# Altium project RF-UNIT-BIG.PrjPcb
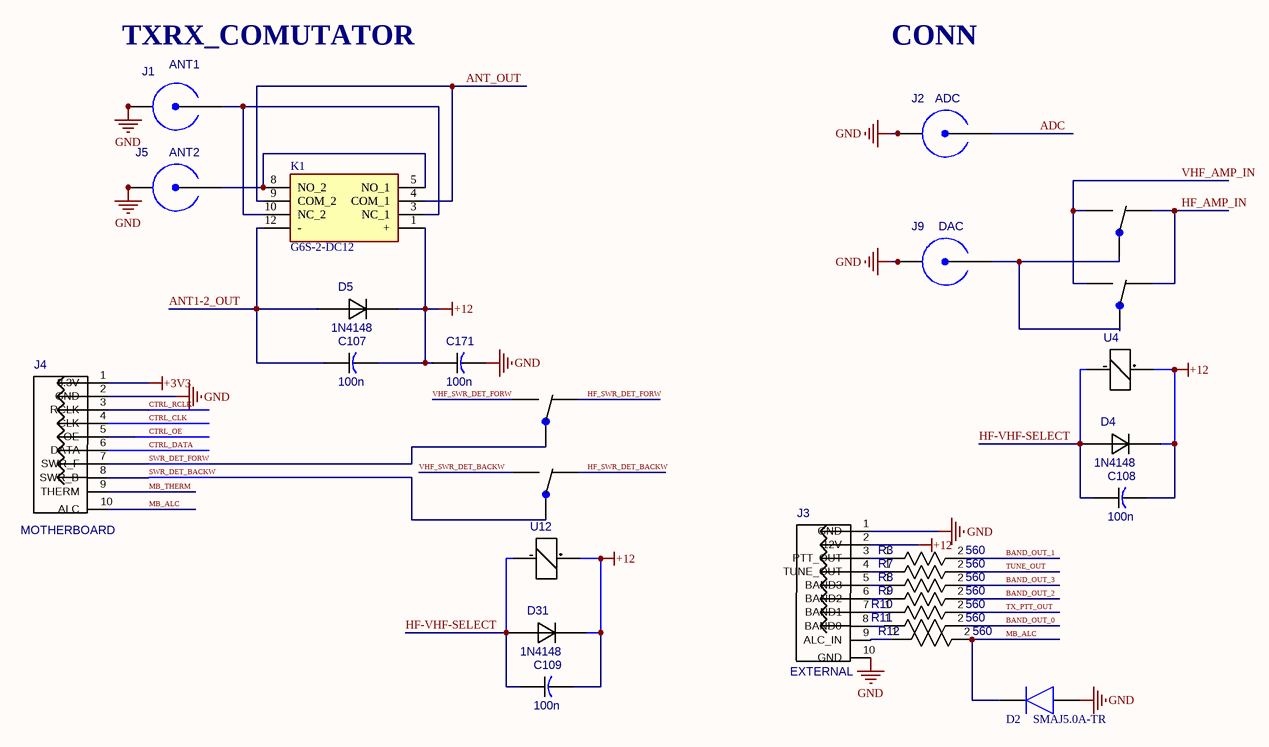
[diagram p0: CONN.SchDoc]
8 sheets, 354 parts. Net scope: global (net labels, ports and power ports of the same name join across sheets).
Board file: RF-UNIT-BIG.PcbDoc
Sheets:
  CONN.SchDoc
  LNA.SchDoc
  BPF.SchDoc
  HF_AMP.SchDoc
  HF_AMP_DRIVER.SchDoc
  SWR_HF.SchDoc
  VHF_AMP.SchDoc
  SWR_VHF.SchDoc

## Sheet CONN.SchDoc: CONNECTIONS
size A4; DocumentNumber: 14; Revision: 2.0; SheetNumber: 14; SheetTotal: 18

### Parts
C107  100n  [CAP_0805]
C108  100n  [CAP_0805]
C109  100n  [CAP_0805]
C171  100n  [CAP_0805]
D2  SMAJ5.0A-TR  [SMBJ36CATR]
D4  1N4148  [SS14]
D5  1N4148  [SS14]
D31  1N4148  [SS14]
J1  ANT1  [31-5431]
J2  ADC  [31-5431]
J3  EXTERNAL  [90131-0126]
J4  MOTHERBOARD  [90131-0126]
J5  ANT2  [31-5431]
J9  DAC  [31-5431]
K1  G6S-2-DC12  [G6S2DC12]
R3  560  [RES_0805]
R7  560  [RES_0805]
R8  560  [RES_0805]
R9  560  [RES_0805]
R10  560  [RES_0805]
R11  560  [RES_0805]
R12  560  [RES_0805]
U4  Axicom IM06  [IM06GR]  (value not drawn)
U12  Axicom IM06  [IM06GR]  (value not drawn)

### Nets
+3V3: J4.1(3.3V)
+12: C107.2 C108.2 C109.2 C171.1 D4.1(K) D5.1(K) D31.1(K) J3.2(12V) K1.1(+) U4.1(+) U12.1(+)
GND: C171.2 D2.2(A) J1.1(GND) J1.2(GND) J1.3(GND) J1.4(GND) J2.1(GND) J2.2(GND) J2.3(GND) J2.4(GND) J3.1(GND) J3.10(GND) J4.2(GND) J5.1(GND) J5.2(GND) J5.3(GND) J5.4(GND) J9.1(GND) J9.2(GND) J9.3(GND) J9.4(GND)
ADC: J2.5(CON)
ANT1-2_OUT: C107.1 D5.2(A) K1.12(-)
ANT_OUT: K1.4(COM_1) K1.9(COM_2)
BAND_OUT_0: R11.2
BAND_OUT_1: R3.2
BAND_OUT_2: R9.2
BAND_OUT_3: R8.2
CTRL_CLK: J4.4(CLK)
CTRL_DATA: J4.6(DATA)
CTRL_OE: J4.5(OE)
CTRL_RCLK: J4.3(RCLK)
HF-VHF-SELECT: C108.1 C109.1 D4.2(A) D31.2(A) U4.8(-) U12.8(-)
HF_AMP_IN: U4.2(O) U4.7(O)
HF_SWR_DET_BACKW: U12.2(O)
HF_SWR_DET_FORW: U12.7(O)
MB_ALC: D2.1(K) J4.10(ALC) R12.2
MB_THERM: J4.9(THERM)
SWR_DET_BACKW: J4.8(SWR_B) U12.3(P)
SWR_DET_FORW: J4.7(SWR_F) U12.6(P)
TUNE_OUT: R7.2
TX_PTT_OUT: R10.2
VHF_AMP_IN: U4.4(S) U4.5(S)
VHF_SWR_DET_BACKW: U12.4(S)
VHF_SWR_DET_FORW: U12.5(S)
NetJ1_5: J1.5(CON) K1.3(NC_1) K1.10(NC_2)
NetJ3_3: J3.3(PTT_OUT) R3.1
NetJ3_4: J3.4(TUNE_OUT) R7.1
NetJ3_5: J3.5(BAND3) R8.1
NetJ3_6: J3.6(BAND2) R9.1
NetJ3_7: J3.7(BAND1) R10.1
NetJ3_8: J3.8(BAND0) R11.1
NetJ3_9: J3.9(ALC_IN) R12.1
NetJ5_5: J5.5(CON) K1.5(NO_1) K1.8(NO_2)
NetJ9_5: J9.5(CON) U4.3(P) U4.6(P)

### Notes on the sheet
- TXRX_COMUTATOR
- CONN
- Title
- Size:
- Date:
- A4
- Number:
- Time:
- Revision:
- Sheet
- of
- File:

### Library data of the parts
C107-C109 C171 = CAP_0805
D2 = SMLVT3V3: Diode; Manufacturer_Name: STMicroelectronics; Allied_Number: 70013736; Datasheet Link: http://www.st.com/web/en/resource/technical/document/datasheet/CD00000923.pdf; Height: 2.65mm; Manufacturer_Part_Number: SMLVT3V3; Mouser Part Number: 511-SMLVT3V3; Mouser Price/Stock: https://www.mouser.com/Search/Refine.aspx?Keyword=511-SMLVT3V3; RS Part Number: 5444821P; RS Price/Stock: http://uk.rs-online.com/web/p/products/5444821P; Allied Price/Stock: http://www.alliedelec.com/stmicroelectronics-smlvt3v3/70013736/
J1 J2 J5 J9 = 31-5431: SMA
  J2: Value: ADC
  J9: Value: DAC
J3 J4 = 90131-0126: 2*5 PIN; Value: *
K1 = G6S-2-DC12: Relay or Contactor; Manufacturer_Name: Omron Electronics; Datasheet Link: https://componentsearchengine.com/Datasheets/1/G6S-2-DC12.pdf; Height: 9.4mm; Manufacturer_Part_Number: G6S-2-DC12; Mouser Part Number: 653-G6S-2-DC12A; Mouser Price/Stock: https://www.mouser.co.uk/ProductDetail/Omron-Electronics/G6S-2-DC12/?qs=QGk6feVlqMLN9Ouv0QsFzA%3D%3D
R3 R7-R12 = RES_0805: Value: 560
D4 D5 D31 = 1N4148: Value: *
U4 U12 = Axicom IM06: Value: *

## Sheet LNA.SchDoc: LNA+ATT
size A4; DocumentNumber: 16; Revision: 2.0; SheetNumber: 16; SheetTotal: 18
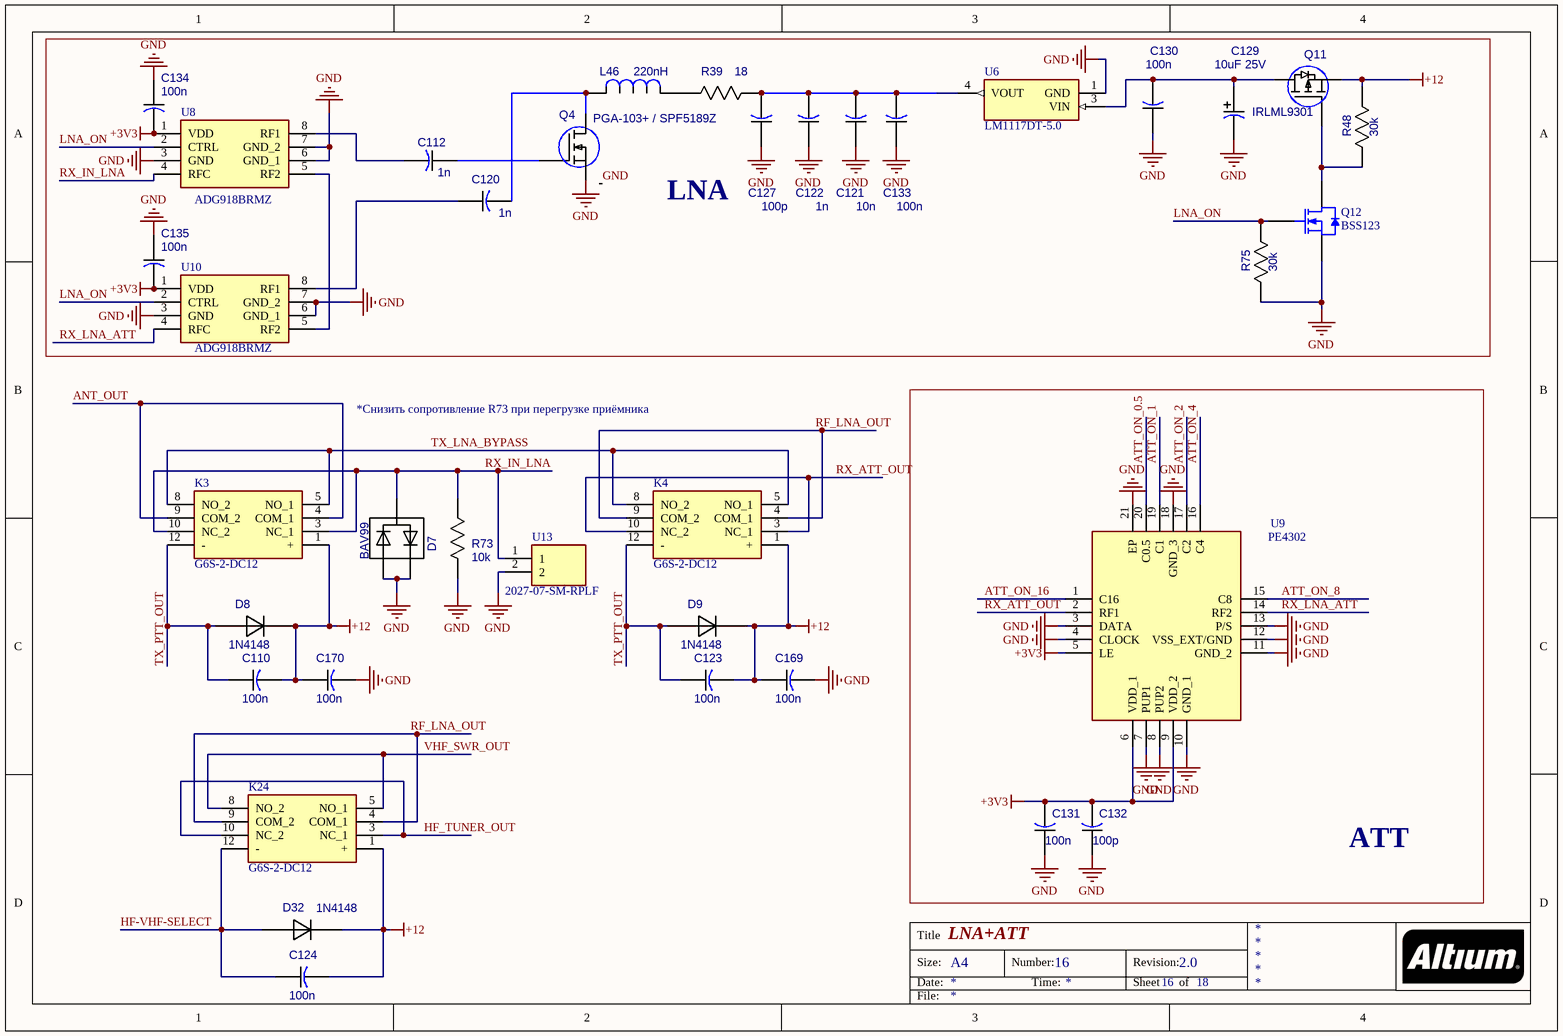
[diagram p1: LNA.SchDoc]

### Parts
C110  100n  [CAP_0805]
C112  1n  [CAP_0805]
C120  1n  [CAP_0805]
C121  10n  [6-0805_M]
C122  1n  [6-0805_M]
C123  100n  [CAP_0805]
C124  100n  [CAP_0805]
C127  100p  [6-0805_M]
C129  10uF 25V  [CAPAE_5.3x5.3h6.1]
C130  100n  [CAP_0805]
C131  100n  [6-0805_M]
C132  100p  [6-0805_M]
C133  100n  [CAP_0805]
C134  100n  [CAP_0805]
C135  100n  [CAP_0805]
C169  100n  [CAP_0805]
C170  100n  [CAP_0805]
D7  BAV99  [SOT23]
D8  1N4148  [SS14]
D9  1N4148  [SS14]
D32  1N4148  [SS14]
K3  G6S-2-DC12  [G6S2DC12]
K4  G6S-2-DC12  [G6S2DC12]
K24  G6S-2-DC12  [G6S2DC12]
L46  220nH  [IND_1206]
Q4  PGA-103+ / SPF5189Z  [SOT89]
Q11  IRLML9301  [SOT23]
Q12  BSS123  [FAIR-SOT23-3_V]
R39  18  [RES_1206]
R48  30k  [RES_0805]
R73  10k  [RES_1206]
R75  30k  [RES_0805]
U6  LM1117DT-5.0  [TO228P991X238-3N]
U8  ADG918BRMZ  [SOP65P490X110-8N]
U9  PE4302  [QFN50P400X400X90-21N]
U10  ADG918BRMZ  [SOP65P490X110-8N]
U13  2027-07-SM-RPLF  [200307SMRPLF]

### Blocks framed on the sheet
LNA: C112 C120-C122 C127 C129 C130 C133-C135 L46 Q4 Q11 Q12 R39 R48 R75 U6 U8 U10
ATT: C131 C132 U9

### Nets
+3V3: C131.2 C132.2 C134.2 C135.2 U8.1(VDD) U9.5(LE) U9.6(VDD_1) U9.9(VDD_2) U10.1(VDD)
+12: C110.2 C123.2 C124.2 C169.1 C170.1 D8.1(K) D9.1(K) D32.1(K) K3.1(+) K4.1(+) K24.1(+) Q11.2(S) R48.2
GND: C121.1 C122.1 C127.1 C129.2(MINUS) C130.1 C131.1 C132.1 C133.1 C134.1 C135.1 C169.2 C170.2 D7.1(A(D1)) D7.2(C(D2)) Q4.0 Q4.2(S) Q12.2(S) R73.1 R75.1 U6.1(GND) U8.3(GND) U8.6(GND_1) U8.7(GND_2) U9.3(DATA) U9.4(CLOCK) U9.7(PUP1) U9.8(PUP2) U9.10(GND_1) U9.11(GND_2) U9.12(VSS_EXT/GND) U9.13(P/S) U9.18(GND_3) U9.21(EP) U10.3(GND) U10.6(GND_1) U10.7(GND_2) U13.2
ANT_OUT: K3.4(COM_1) K3.9(COM_2)
ATT_ON_0.5: U9.20(C0.5)
ATT_ON_1: U9.19(C1)
ATT_ON_2: U9.17(C2)
ATT_ON_4: U9.16(C4)
ATT_ON_8: U9.15(C8)
ATT_ON_16: U9.1(C16)
HF-VHF-SELECT: C124.1 D32.2(A) K24.12(-)
HF_TUNER_OUT: K24.3(NC_1) K24.10(NC_2)
LNA_ON: Q12.1(G) R75.2 U8.2(CTRL) U10.2(CTRL)
RF_LNA_OUT: K4.4(COM_1) K4.9(COM_2) K24.4(COM_1) K24.9(COM_2)
RX_ATT_OUT: K4.3(NC_1) K4.10(NC_2) U9.2(RF1)
RX_IN_LNA: D7.3(C(D1),A(D2)) K3.3(NC_1) K3.10(NC_2) R73.2 U8.4(RFC) U13.1
RX_LNA_ATT: U9.14(RF2) U10.4(RFC)
TX_LNA_BYPASS: K3.5(NO_1) K3.8(NO_2) K4.5(NO_1) K4.8(NO_2)
TX_PTT_OUT: C110.1 C123.1 D8.2(A) D9.2(A) K3.12(-) K4.12(-)
VHF_SWR_OUT: K24.5(NO_1) K24.8(NO_2)
NetC112_1: C112.1 Q4.1(G)
NetC112_2: C112.2 U8.8(RF1)
NetC120_1: C120.1 U10.8(RF1)
NetC120_2: C120.2 L46.2 Q4.3(D)
NetC121_2: C121.2 C122.2 C127.2 C133.2 R39.1 U6.4(VOUT)
NetC129_1: C129.1(PLUS) C130.2 Q11.3(D) U6.3(VIN)
NetL46_1: L46.1 R39.2
NetQ11_1: Q11.1(G) Q12.3(D) R48.1
NetU8_5: U8.5(RF2) U10.5(RF2)

### Notes on the sheet
- *Снизить сопротивление R73 при перегрузке приёмника
- Title
- Size:
- Date:
- A4
- Number:
- Time:
- Revision:
- Sheet
- of
- File:

### Library data of the parts
C110 C112 C120-C124 C127 C130-C135 C169 C170 = CAP_0805
  C121: Value: 10n
  C122: Value: 1n
  C127 C132: Value: 100p
  C130 C131 C133-C135: Value: 100n
C129 = CAPAE_5.3x5.3h6.1: Value: 10uF 25V
K3 K4 K24 = G6S-2-DC12: as K1 on sheet CONN; Datasheet Link: https://componentsearchengine.com/Datasheets/1/G6S-2-DC12.pdf; Height: 9.4mm; Manufacturer_Part_Number: G6S-2-DC12; Mouser Part Number: 653-G6S-2-DC12A; Mouser Price/Stock: https://www.mouser.co.uk/ProductDetail/Omron-Electronics/G6S-2-DC12/?qs=QGk6feVlqMLN9Ouv0QsFzA%3D%3D
L46 = IND_1206: Value: 220nH
Q4 = PGA-103+
Q11 = MOSFET_ENH_PD: MOSFET; Value: IRLML9301
Q12 = CMP-2000-04934-1: N-Channel Logic Level Enhancement Mode Field Effect Transistor, 1.7 V, -55 to 150 degC, 3-Pin SOT-23, RoHS, Tape and Reel; Manufacturer: Fairchild; Channel Type: N; Typical Turn-Off Delay Time: 17ns; Maximum Continuous Drain Current: 0.17A; Rad Hard: No; Typical Rise Time: 9ns; Typical Fall Time: 2.4ns; Maximum Gate Source Voltage: ±20V; Maximum Drain Source Voltage: 100V; Typical Turn-On Delay Time: 1.7ns; RDS-on: 6000@10VmOhm; Package Version: Rev. 12, 03/2016; Packaging: Tape&Reel; Package Reference: SOT23-3; Channel Mode: Enhancement; Operating Temperature: -55to150degC; Package Description: 3-Pin Small Outline Transistor, Body 2.92 x 1.325 mm, Pitch 0.95 mm; Category: MOSFET; Datasheet Version: Jun-03; Datasheet URL: https://www.fairchildsemi.com/datasheets/BS/BSS123.pdf; Manufacturer URL: https://www.fairchildsemi.com/; Mounting: SurfaceMount; Package: 3SOT-23; Package URL: http://www.fairchildsemi.com/dwg/MA/MA03D.pdf
R39 R73 = RES_1206
  R39: Value: 18
R48 R75 = RES_0805: Value: 30k
U6 = LM1117DT-ADJ: Integrated Circuit; Manufacturer_Name: Texas Instruments; Datasheet Link: http://www.ti.com/lit/ds/symlink/lm1117-n.pdf; Height: 2.38mm; Manufacturer_Part_Number: LM1117DT-ADJ; Mouser Part Number: 926-LM1117DT-ADJ; Mouser Price/Stock: https://www.mouser.com/Search/Refine.aspx?Keyword=926-LM1117DT-ADJ
U8 U10 = ADG918BRMZ: Integrated Circuit; Manufacturer_Name: Analog Devices; Datasheet Link: http://www.analog.com/static/imported-files/data_sheets/ADG918_919.pdf; Height: 1.1mm; Manufacturer_Part_Number: ADG918BRMZ; Mouser Part Number: 584-ADG918BRMZ; Mouser Price/Stock: https://www.mouser.co.uk/ProductDetail/Analog-Devices/ADG918BRMZ?qs=BpaRKvA4VqHrp1TCwMhfnw%3D%3D; RS Part Number: 4969212P; RS Price/Stock: http://uk.rs-online.com/web/p/products/4969212P
U9 = PE4312C-Z: Integrated Circuit; Manufacturer_Name: pSemi; Datasheet Link: https://www.psemi.com/pdf/datasheets/pe4312ds.pdf; Height: 0.9mm; Manufacturer_Part_Number: PE4312C-Z; Mouser Part Number: N/A; Mouser Price/Stock: https://www.mouser.com/Search/Refine.aspx?Keyword=N%2FA
U13 = 2003-07-SM-RPLF: Undefined or Miscellaneous; Manufacturer_Name: Bourns; Datasheet Link: https://www.arrow.com/en/products/2003-07-sm-rplf/bourns; Height: 3.7mm; Manufacturer_Part_Number: 2003-07-SM-RPLF; Mouser Part Number: 652-2003-07-SM-RPLF; Mouser Price/Stock: https://www.mouser.co.uk/ProductDetail/Bourns/2003-07-SM-RPLF?qs=j%252B1pi9TdxUaYVLyv%2F6mAaA%3D%3D; Arrow Part Number: 2003-07-SM-RPLF; Arrow Price/Stock: https://www.arrow.com/en/products/2003-07-sm-rplf/bourns
D7 = BAV99: Value: BAV99
D8 D9 D32 = 1N4148: Value: *

## Sheet BPF.SchDoc: BPF
size A2 portrait; DocumentNumber: 13; Revision: 2.0; SheetNumber: 13; SheetTotal: 18; DocumentName: Лист 1.SCHDOC
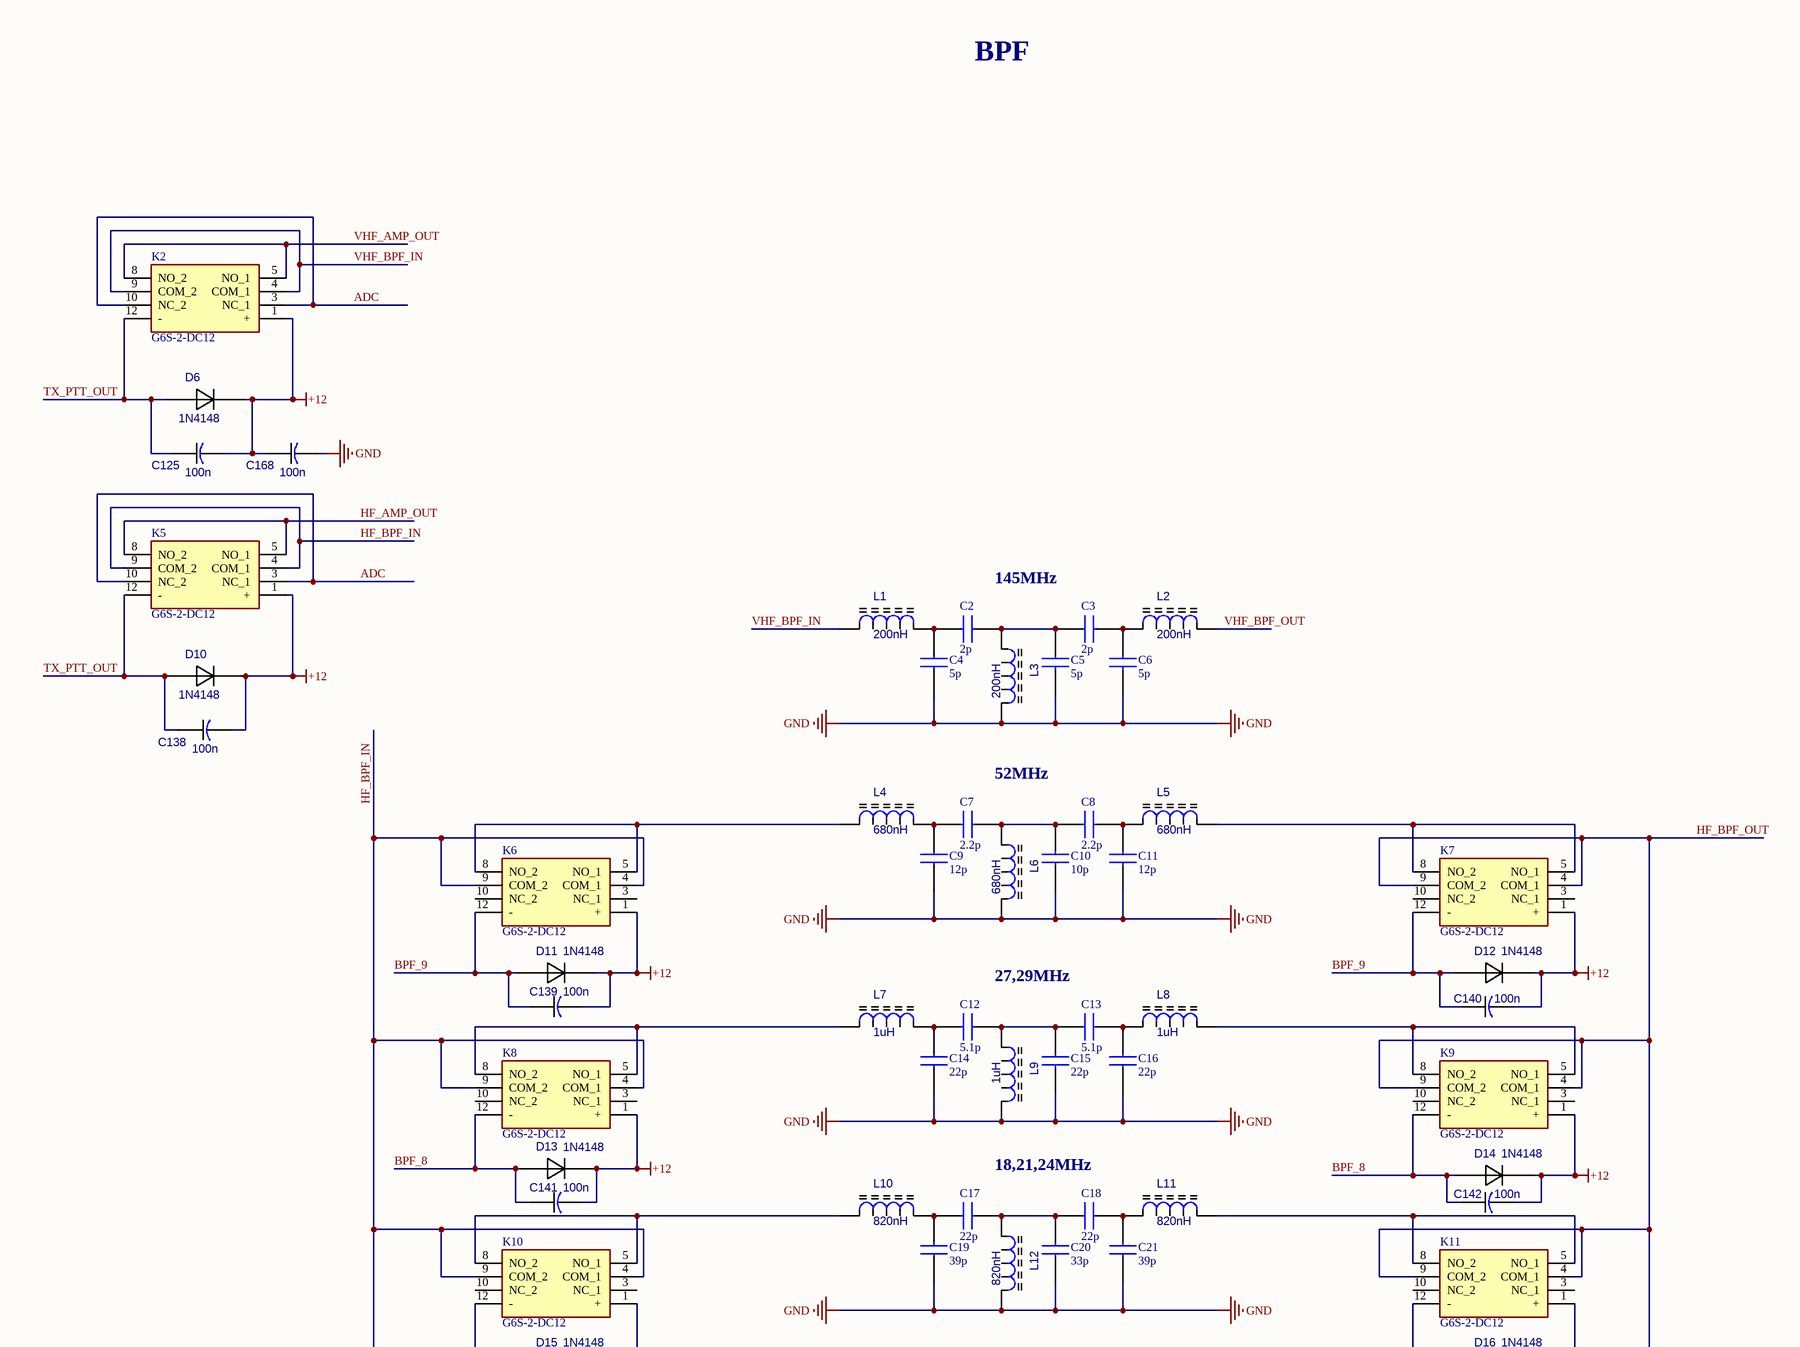
[diagram p2: BPF.SchDoc, top]
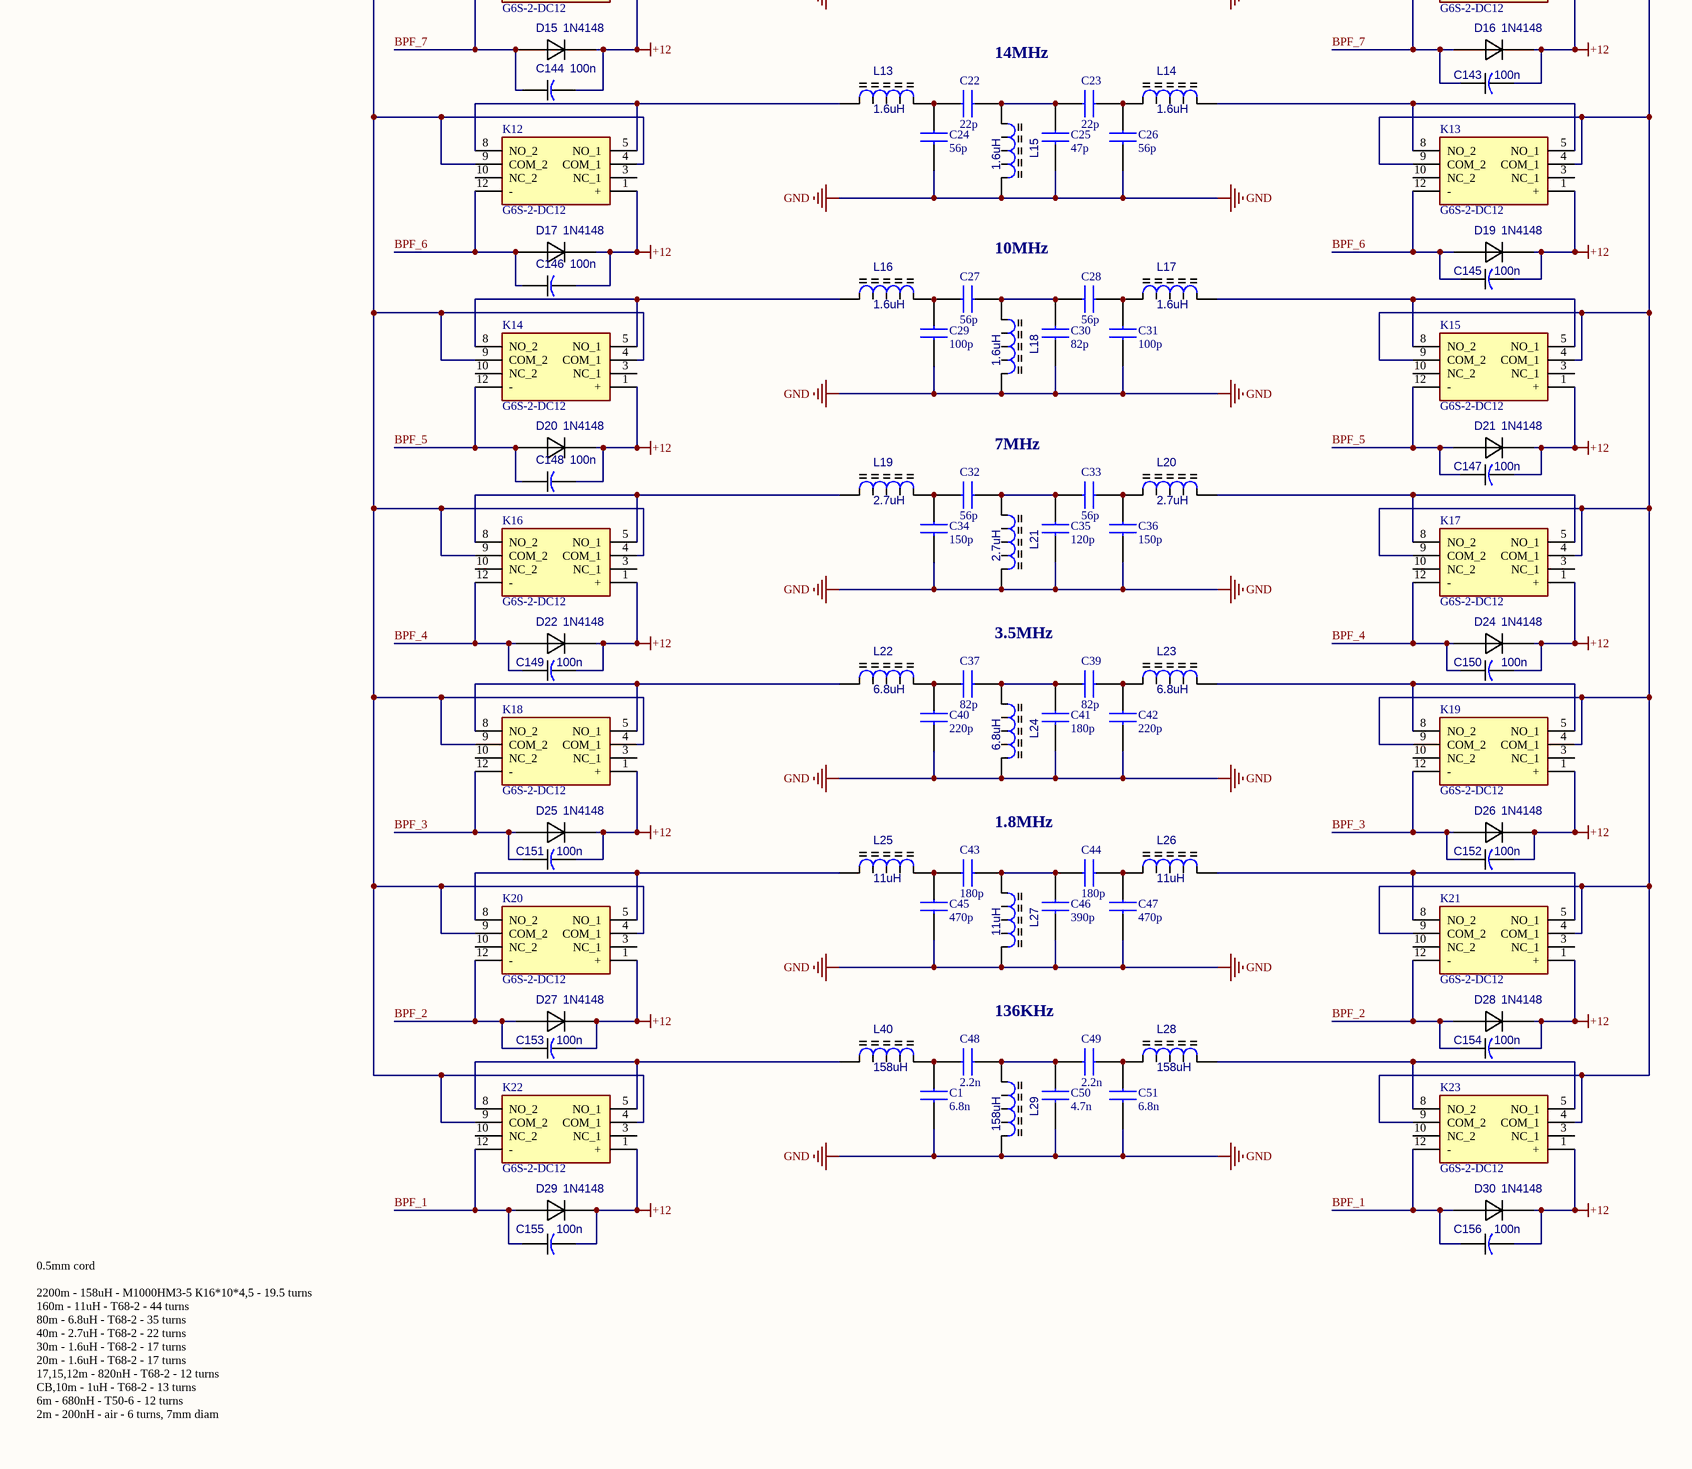
[diagram p3: BPF.SchDoc, bottom]

### Parts
C1  6.8n  [CAP_1206]
C2  2p  [CAP_1206]
C3  2p  [CAP_1206]
C4  5p  [CAP_1206]
C5  5p  [CAP_1206]
C6  5p  [CAP_1206]
C7  2.2p  [CAP_1206]
C8  2.2p  [CAP_1206]
C9  12p  [CAP_1206]
C10  10p  [CAP_1206]
C11  12p  [CAP_1206]
C12  5.1p  [CAP_1206]
C13  5.1p  [CAP_1206]
C14  22p  [CAP_1206]
C15  22p  [CAP_1206]
C16  22p  [CAP_1206]
C17  22p  [CAP_1206]
C18  22p  [CAP_1206]
C19  39p  [CAP_1206]
C20  33p  [CAP_1206]
C21  39p  [CAP_1206]
C22  22p  [CAP_1206]
C23  22p  [CAP_1206]
C24  56p  [CAP_1206]
C25  47p  [CAP_1206]
C26  56p  [CAP_1206]
C27  56p  [CAP_1206]
C28  56p  [CAP_1206]
C29  100p  [CAP_1206]
C30  82p  [CAP_1206]
C31  100p  [CAP_1206]
C32  56p  [CAP_1206]
C33  56p  [CAP_1206]
C34  150p  [CAP_1206]
C35  120p  [CAP_1206]
C36  150p  [CAP_1206]
C37  82p  [CAP_1206]
C39  82p  [CAP_1206]
C40  220p  [CAP_1206]
C41  180p  [CAP_1206]
C42  220p  [CAP_1206]
C43  180p  [CAP_1206]
C44  180p  [CAP_1206]
C45  470p  [CAP_1206]
C46  390p  [CAP_1206]
C47  470p  [CAP_1206]
C48  2.2n  [CAP_1206]
C49  2.2n  [CAP_1206]
C50  4.7n  [CAP_1206]
C51  6.8n  [CAP_1206]
C125  100n  [CAP_0805]
C138  100n  [CAP_0805]
C139  100n  [CAP_0805]
C140  100n  [CAP_0805]
C141  100n  [CAP_0805]
C142  100n  [CAP_0805]
C143  100n  [CAP_0805]
C144  100n  [CAP_0805]
C145  100n  [CAP_0805]
C146  100n  [CAP_0805]
C147  100n  [CAP_0805]
C148  100n  [CAP_0805]
C149  100n  [CAP_0805]
C150  100n  [CAP_0805]
C151  100n  [CAP_0805]
C152  100n  [CAP_0805]
C153  100n  [CAP_0805]
C154  100n  [CAP_0805]
C155  100n  [CAP_0805]
C156  100n  [CAP_0805]
C168  100n  [CAP_0805]
D6  1N4148  [SS14]
D10  1N4148  [SS14]
D11  1N4148  [SS14]
D12  1N4148  [SS14]
D13  1N4148  [SS14]
D14  1N4148  [SS14]
D15  1N4148  [SS14]
D16  1N4148  [SS14]
D17  1N4148  [SS14]
D19  1N4148  [SS14]
D20  1N4148  [SS14]
D21  1N4148  [SS14]
D22  1N4148  [SS14]
D24  1N4148  [SS14]
D25  1N4148  [SS14]
D26  1N4148  [SS14]
D27  1N4148  [SS14]
D28  1N4148  [SS14]
D29  1N4148  [SS14]
D30  1N4148  [SS14]
K2  G6S-2-DC12  [G6S2DC12]
K5  G6S-2-DC12  [G6S2DC12]
K6  G6S-2-DC12  [G6S2DC12]
K7  G6S-2-DC12  [G6S2DC12]
K8  G6S-2-DC12  [G6S2DC12]
K9  G6S-2-DC12  [G6S2DC12]
K10  G6S-2-DC12  [G6S2DC12]
K11  G6S-2-DC12  [G6S2DC12]
K12  G6S-2-DC12  [G6S2DC12]
K13  G6S-2-DC12  [G6S2DC12]
K14  G6S-2-DC12  [G6S2DC12]
K15  G6S-2-DC12  [G6S2DC12]
K16  G6S-2-DC12  [G6S2DC12]
K17  G6S-2-DC12  [G6S2DC12]
K18  G6S-2-DC12  [G6S2DC12]
K19  G6S-2-DC12  [G6S2DC12]
K20  G6S-2-DC12  [G6S2DC12]
K21  G6S-2-DC12  [G6S2DC12]
K22  G6S-2-DC12  [G6S2DC12]
K23  G6S-2-DC12  [G6S2DC12]
L1  200nH  [IND_FERRITE_CORE_1]
L2  200nH  [IND_FERRITE_CORE_1]
L3  200nH  [IND_FERRITE_CORE_1]
L4  680nH  [IND_FERRITE_CORE_1]
L5  680nH  [IND_FERRITE_CORE_1]
L6  680nH  [IND_FERRITE_CORE_1]
L7  1uH  [IND_FERRITE_CORE_1]
L8  1uH  [IND_FERRITE_CORE_1]
L9  1uH  [IND_FERRITE_CORE_1]
L10  820nH  [IND_FERRITE_CORE_1]
L11  820nH  [IND_FERRITE_CORE_1]
L12  820nH  [IND_FERRITE_CORE_1]
L13  1.6uH  [IND_FERRITE_CORE_1]
L14  1.6uH  [IND_FERRITE_CORE_1]
L15  1.6uH  [IND_FERRITE_CORE_1]
L16  1.6uH  [IND_FERRITE_CORE_1]
L17  1.6uH  [IND_FERRITE_CORE_1]
L18  1.6uH  [IND_FERRITE_CORE_1]
L19  2.7uH  [IND_FERRITE_CORE_1]
L20  2.7uH  [IND_FERRITE_CORE_1]
L21  2.7uH  [IND_FERRITE_CORE_1]
L22  6.8uH  [IND_FERRITE_CORE_1]
L23  6.8uH  [IND_FERRITE_CORE_1]
L24  6.8uH  [IND_FERRITE_CORE_1]
L25  11uH  [IND_FERRITE_CORE_1]
L26  11uH  [IND_FERRITE_CORE_1]
L27  11uH  [IND_FERRITE_CORE_1]
L28  158uH  [IND_FERRITE_CORE_1]
L29  158uH  [IND_FERRITE_CORE_1]
L40  158uH  [IND_FERRITE_CORE_1]

### Nets
+12: C125.2 C138.2 C139.2 C140.2 C141.2 C142.2 C143.2 C144.2 C145.2 C146.2 C147.2 C148.2 C149.2 C150.2 C151.2 C152.2 C153.2 C154.2 C155.2 C156.2 C168.1 D6.1(K) D10.1(K) D11.1(K) D12.1(K) D13.1(K) D14.1(K) D15.1(K) D16.1(K) D17.1(K) D19.1(K) D20.1(K) D21.1(K) D22.1(K) D24.1(K) D25.1(K) D26.1(K) D27.1(K) D28.1(K) D29.1(K) D30.1(K) K2.1(+) K5.1(+) K6.1(+) K7.1(+) K8.1(+) K9.1(+) K10.1(+) K11.1(+) K12.1(+) K13.1(+) K14.1(+) K15.1(+) K16.1(+) K17.1(+) K18.1(+) K19.1(+) K20.1(+) K21.1(+) K22.1(+) K23.1(+)
GND: C1.1 C4.1 C5.1 C6.1 C9.1 C10.1 C11.1 C14.1 C15.1 C16.1 C19.1 C20.1 C21.1 C24.1 C25.1 C26.1 C29.1 C30.1 C31.1 C34.1 C35.1 C36.1 C40.1 C41.1 C42.1 C45.1 C46.1 C47.1 C50.1 C51.1 C168.2 L3.2(B) L6.2(B) L9.2(B) L12.2(B) L15.2(B) L18.2(B) L21.2(B) L24.2(B) L27.2(B) L29.2(B)
ADC: K2.3(NC_1) K2.10(NC_2) K5.3(NC_1) K5.10(NC_2)
BPF_1: C155.1 C156.1 D29.2(A) D30.2(A) K22.12(-) K23.12(-)
BPF_2: C153.1 C154.1 D27.2(A) D28.2(A) K20.12(-) K21.12(-)
BPF_3: C151.1 C152.1 D25.2(A) D26.2(A) K18.12(-) K19.12(-)
BPF_4: C149.1 C150.1 D22.2(A) D24.2(A) K16.12(-) K17.12(-)
BPF_5: C147.1 C148.1 D20.2(A) D21.2(A) K14.12(-) K15.12(-)
BPF_6: C145.1 C146.1 D17.2(A) D19.2(A) K12.12(-) K13.12(-)
BPF_7: C143.1 C144.1 D15.2(A) D16.2(A) K10.12(-) K11.12(-)
BPF_8: C141.1 C142.1 D13.2(A) D14.2(A) K8.12(-) K9.12(-)
BPF_9: C139.1 C140.1 D11.2(A) D12.2(A) K6.12(-) K7.12(-)
HF_AMP_OUT: K5.5(NO_1) K5.8(NO_2)
HF_BPF_IN: K5.4(COM_1) K5.9(COM_2) K6.4(COM_1) K6.9(COM_2) K8.4(COM_1) K8.9(COM_2) K10.4(COM_1) K10.9(COM_2) K12.4(COM_1) K12.9(COM_2) K14.4(COM_1) K14.9(COM_2) K16.4(COM_1) K16.9(COM_2) K18.4(COM_1) K18.9(COM_2) K20.4(COM_1) K20.9(COM_2) K22.4(COM_1) K22.9(COM_2)
HF_BPF_OUT: K7.4(COM_1) K7.9(COM_2) K9.4(COM_1) K9.9(COM_2) K11.4(COM_1) K11.9(COM_2) K13.4(COM_1) K13.9(COM_2) K15.4(COM_1) K15.9(COM_2) K17.4(COM_1) K17.9(COM_2) K19.4(COM_1) K19.9(COM_2) K21.4(COM_1) K21.9(COM_2) K23.4(COM_1) K23.9(COM_2)
TX_PTT_OUT: C125.1 C138.1 D6.2(A) D10.2(A) K2.12(-) K5.12(-)
VHF_AMP_OUT: K2.5(NO_1) K2.8(NO_2)
VHF_BPF_IN: K2.4(COM_1) K2.9(COM_2) L1.1(A)
VHF_BPF_OUT: L2.2(B)
NetC1_2: C1.2 C48.2 L40.2(B)
NetC2_1: C2.1 C3.2 C5.2 L3.1(A)
NetC2_2: C2.2 C4.2 L1.2(B)
NetC3_1: C3.1 C6.2 L2.1(A)
NetC7_1: C7.1 C8.2 C10.2 L6.1(A)
NetC7_2: C7.2 C9.2 L4.2(B)
NetC8_1: C8.1 C11.2 L5.1(A)
NetC12_1: C12.1 C13.2 C15.2 L9.1(A)
NetC12_2: C12.2 C14.2 L7.2(B)
NetC13_1: C13.1 C16.2 L8.1(A)
NetC17_1: C17.1 C18.2 C20.2 L12.1(A)
NetC17_2: C17.2 C19.2 L10.2(B)
NetC18_1: C18.1 C21.2 L11.1(A)
NetC22_1: C22.1 C23.2 C25.2 L15.1(A)
NetC22_2: C22.2 C24.2 L13.2(B)
NetC23_1: C23.1 C26.2 L14.1(A)
NetC27_1: C27.1 C28.2 C30.2 L18.1(A)
NetC27_2: C27.2 C29.2 L16.2(B)
NetC28_1: C28.1 C31.2 L17.1(A)
NetC32_1: C32.1 C33.2 C35.2 L21.1(A)
NetC32_2: C32.2 C34.2 L19.2(B)
NetC33_1: C33.1 C36.2 L20.1(A)
NetC37_1: C37.1 C39.2 C41.2 L24.1(A)
NetC37_2: C37.2 C40.2 L22.2(B)
NetC39_1: C39.1 C42.2 L23.1(A)
NetC43_1: C43.1 C44.2 C46.2 L27.1(A)
NetC43_2: C43.2 C45.2 L25.2(B)
NetC44_1: C44.1 C47.2 L26.1(A)
NetC48_1: C48.1 C49.2 C50.2 L29.1(A)
NetC49_1: C49.1 C51.2 L28.1(A)
NetK6_5: K6.5(NO_1) K6.8(NO_2) L4.1(A)
NetK7_5: K7.5(NO_1) K7.8(NO_2) L5.2(B)
NetK8_5: K8.5(NO_1) K8.8(NO_2) L7.1(A)
NetK9_5: K9.5(NO_1) K9.8(NO_2) L8.2(B)
NetK10_5: K10.5(NO_1) K10.8(NO_2) L10.1(A)
NetK11_5: K11.5(NO_1) K11.8(NO_2) L11.2(B)
NetK12_5: K12.5(NO_1) K12.8(NO_2) L13.1(A)
NetK13_5: K13.5(NO_1) K13.8(NO_2) L14.2(B)
NetK14_5: K14.5(NO_1) K14.8(NO_2) L16.1(A)
NetK15_5: K15.5(NO_1) K15.8(NO_2) L17.2(B)
NetK16_5: K16.5(NO_1) K16.8(NO_2) L19.1(A)
NetK17_5: K17.5(NO_1) K17.8(NO_2) L20.2(B)
NetK18_5: K18.5(NO_1) K18.8(NO_2) L22.1(A)
NetK19_5: K19.5(NO_1) K19.8(NO_2) L23.2(B)
NetK20_5: K20.5(NO_1) K20.8(NO_2) L25.1(A)
NetK21_5: K21.5(NO_1) K21.8(NO_2) L26.2(B)
NetK22_5: K22.5(NO_1) K22.8(NO_2) L40.1(A)
NetK23_5: K23.5(NO_1) K23.8(NO_2) L28.2(B)

Not connected (* = marked no-connect by the designer): K6 3(NC_1) 10(NC_2); K7 3(NC_1) 10(NC_2); K8 3(NC_1) 10(NC_2); K9 3(NC_1) 10(NC_2); K10 3(NC_1) 10(NC_2); K11 3(NC_1) 10(NC_2); K12 3(NC_1) 10(NC_2); K13 3(NC_1) 10(NC_2); K14 3(NC_1) 10(NC_2); K15 3(NC_1) 10(NC_2); K16 3(NC_1) 10(NC_2); K17 3(NC_1) 10(NC_2); K18 3(NC_1) 10(NC_2); K19 3(NC_1) 10(NC_2); K20 3(NC_1) 10(NC_2); K21 3(NC_1) 10(NC_2); K22 3(NC_1) 10(NC_2); K23 3(NC_1) 10(NC_2)

### Notes on the sheet
- BPF
- 145MHz
- 52MHz
- 27,29MHz
- 18,21,24MHz
- 14MHz
- 10MHz
- 7MHz
- 3.5MHz
- 1.8MHz
- 136KHz
- 0.5mm cord
  2200m - 158uH - М1000НМ3-5 К16*10*4,5 - 19.5 turns
  160m - 11uH - T68-2 - 44 turns
  80m - 6.8uH - T68-2 - 35 turns
  40m - 2.7uH - T68-2 - 22 turns
  30m - 1.6uH - T68-2 - 17 turns
  20m - 1.6uH - T68-2 - 17 turns
  17,15,12m - 820nH - T68-2 - 12 turns
  CB,10m - 1uH - T68-2 - 13 turns
  6m - 680nH - T50-6 - 12 turns
  2m - 200nH - air - 6 turns, 7mm diam
- Title
- Size:
- Date:
- File:
- A2
- Number:
- Time:
- Revision:
- Sheet
- of

### Library data of the parts
C1-C37 C39-C51 = B32620A0682J000: Capacitor NP0 HiVolt; Manufacturer_Name: TDK; Datasheet Link: https://www.tdk-electronics.tdk.com/inf/20/20/db/fc_2009/MKP_B32620_621.pdf; Height: 12mm; Manufacturer_Part_Number: B32620A0682J000; Mouser Part Number: 871-B32620A682J; Mouser Price/Stock: https://www.mouser.com/Search/Refine.aspx?Keyword=871-B32620A682J
C125 C138-C156 C168 = CAP_0805
K2 K5-K23 = G6S-2-DC12: as K1 on sheet CONN; Datasheet Link: https://componentsearchengine.com/Datasheets/1/G6S-2-DC12.pdf; Height: 9.4mm; Manufacturer_Part_Number: G6S-2-DC12; Mouser Part Number: 653-G6S-2-DC12A; Mouser Price/Stock: https://www.mouser.co.uk/ProductDetail/Omron-Electronics/G6S-2-DC12/?qs=QGk6feVlqMLN9Ouv0QsFzA%3D%3D
L1-L29 L40 = IND_FERRITE_CORE: Inductor
D6 D10-D17 D19-D22 D24-D30 = 1N4148: Value: *

## Sheet HF_AMP.SchDoc: HF RF AMP
size A4; DocumentNumber: 17; Revision: 2.0; SheetNumber: 17; SheetTotal: 18
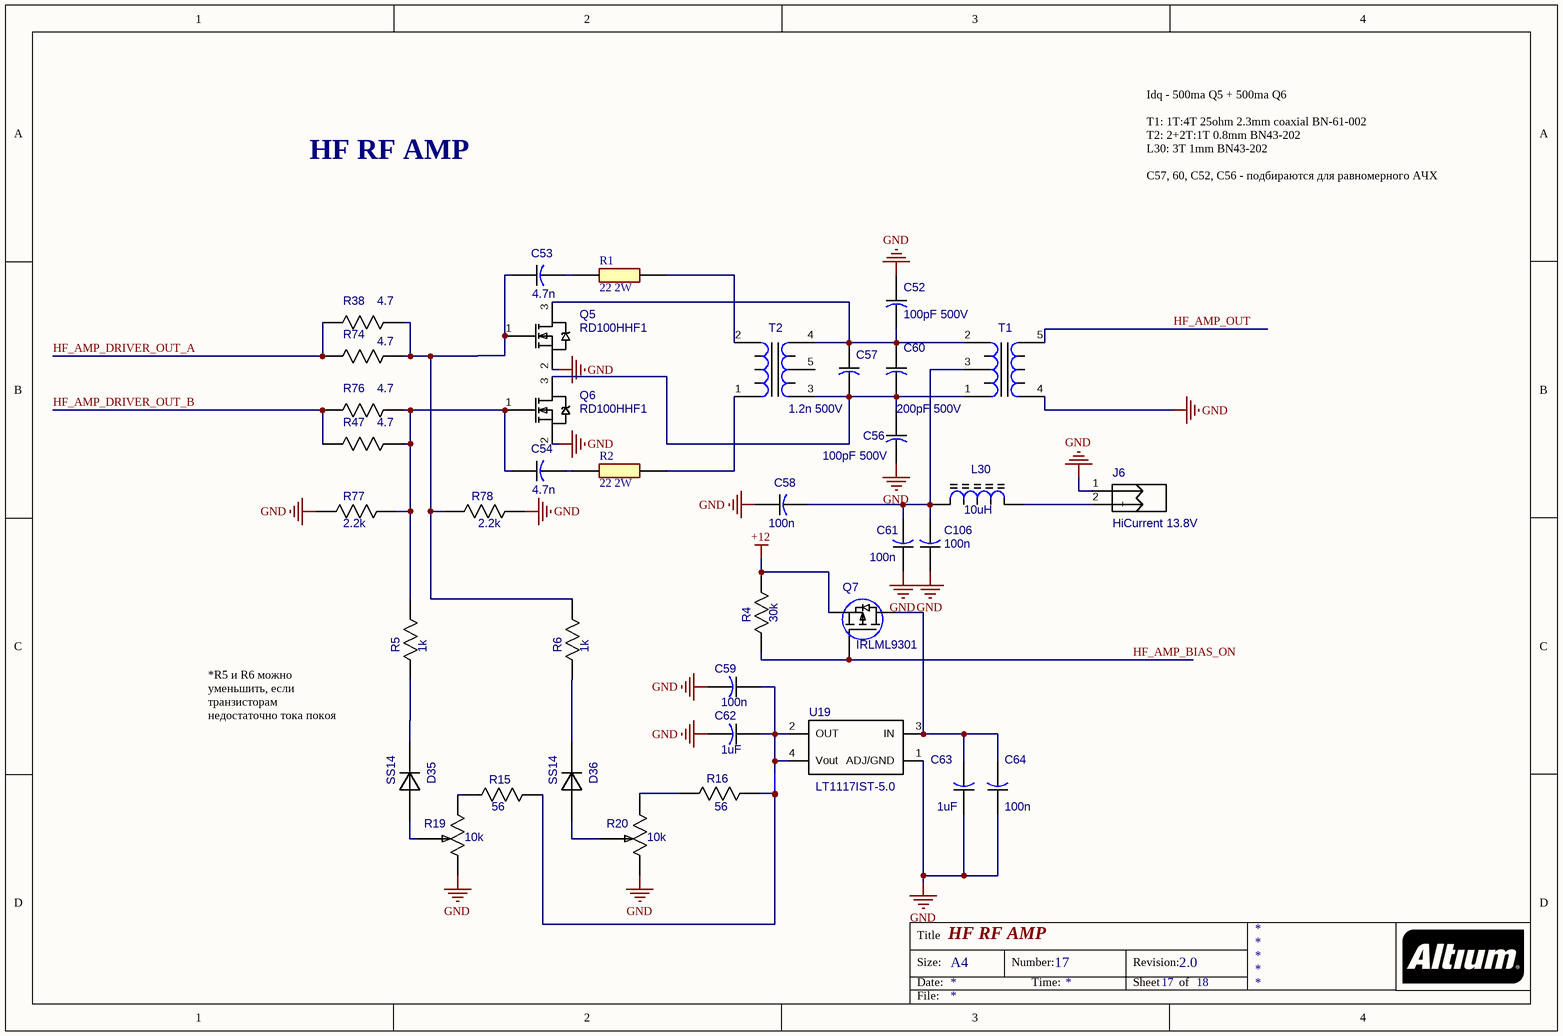
[diagram p4: HF_AMP.SchDoc]

### Parts
C52  100pF 500V  [CAP_1206]
C53  4.7n  [CAP_1206]
C54  4.7n  [CAP_1206]
C56  100pF 500V  [CAP_1206]
C57  1.2n 500V  [CAP_1206]
C58  100n  [CAP_1206]
C59  100n  [CAP_0805]
C60  200pF 500V  [CAP_1206]
C61  100n  [CAP_1206]
C62  1uF  [CAP_0805]
C63  1uF  [CAP_0805]
C64  100n  [CAP_0805]
C106  100n  [CAP_1206]
D35  SS14  [SS14]
D36  SS14  [SS14]
J6  HiCurrent 13.8V  [1986717-2]
L30  10uH  [IND_FERRITE_CORE]
Q5  RD100HHF1  [RD100_V2]
Q6  RD100HHF1  [RD100_V2]
Q7  IRLML9301  [SOT23]
R1  22 2W  [RES-2W]
R2  22 2W  [RES-2W]
R4  30k  [RES_0805]
R5  1k  [RES_0805]
R6  1k  [RES_0805]
R15  56  [RES_0805]
R16  56  [RES_0805]
R19  value 10k  [3296W-1]  (hidden comment: ADJ-10k)
R20  value 10k  [3296W-1]  (hidden comment: ADJ-10k)
R38  4.7  [RES_1206]
R47  4.7  [RES_1206]
R74  4.7  [RES_1206]
R76  4.7  [RES_1206]
R77  2.2k  [RES_0805]
R78  2.2k  [RES_0805]
T1  TRANSF_HF2  [TRANSF_HF2-3]  (value not drawn)
T2  TRANSF_HF1  [TRANSF_HF1]  (value not drawn)
U19  LT1117IST-5.0  [LT1117IST-ADJ]

### Nets
+12: Q7.2(S) R4.2
GND: C52.1 C56.2 C58.1 C59.2 C61.1 C62.2 C63.1 C64.1 C106.1 J6.1(-) Q5.2(S) Q6.2(S) R19.1(CCW) R20.1(CCW) R77.1 R78.2 T1.4(S1) U19.1(ADJ/GND)
HF_AMP_BIAS_ON: Q7.1(G) R4.1
HF_AMP_DRIVER_OUT_A: R38.1 R74.1
HF_AMP_DRIVER_OUT_B: R47.1 R76.1
HF_AMP_OUT: T1.5(S2)
NetC52_2: C52.2 C57.1 C60.1 Q5.3(D) T1.2(P2) T2.4(S2)
NetC53_1: C53.1 Q5.1(G) R6.2 R38.2 R74.2 R78.1
NetC53_2: C53.2 R1.1
NetC54_1: C54.1 Q6.1(G) R5.2 R47.2 R76.2 R77.2
NetC54_2: C54.2 R2.1
NetC56_1: C56.1 C57.2 C60.2 Q6.3(D) T1.1(P1) T2.3(S1)
NetC58_2: C58.2 C61.2 C106.2 L30.1(A) T1.3(P3)
NetC59_1: C59.1 C62.1 R15.2 R16.2 U19.2(OUT) U19.4(Vout)
NetC63_2: C63.2 C64.2 Q7.3(D) U19.3(IN)
NetD35_1: D35.1(K) R5.1
NetD35_2: D35.2(A) R19.2(W)
NetD36_1: D36.1(K) R6.1
NetD36_2: D36.2(A) R20.2(W)
NetJ6_2: J6.2(+) L30.2(B)
NetR1_2: R1.2 T2.2(P2)
NetR2_2: R2.2 T2.1(P1)
NetR15_1: R15.1 R19.3(CW)
NetR16_1: R16.1 R20.3(CW)

Not connected (* = marked no-connect by the designer): T2 5(S3)

### Notes on the sheet
- HF RF AMP
- Idq - 500ma Q5 + 500ma Q6
  T1: 1T:4T 25ohm 2.3mm coaxial BN-61-002
  T2: 2+2T:1T 0.8mm BN43-202
  L30: 3T 1mm BN43-202
  C57, 60, C52, C56 - подбираются для равномерного АЧХ
- *R5 и R6 можно уменьшить, если транзисторам недостаточно тока покоя
- Title
- Size:
- Date:
- A4
- Number:
- Time:
- Revision:
- Sheet
- of
- File:

### Library data of the parts
C52-C54 C56-C58 C60 C61 C106 = CAP_1206
C59 C62-C64 = CAP_0805
  C59 C64: Value: 100n
  C62 C63: Value: 1uF
J6 = 1986717-2: JX2
L30 = IND_FERRITE_CORE: Inductor; Value: 10uH
Q7 = MOSFET_ENH_PD: MOSFET; Value: IRLML9301
R1 R2 = CFR200J100R: Manufacturer_Name: TE Connectivity; Datasheet Link: http://www.te.com/commerce/DocumentDelivery/DDEController?Action=showdoc&DocId=Data+Sheet%7F1773195%7FE%7Fpdf%7FEnglish%7FENG_DS_1773195_E.pdf%7F1623929-2; Manufacturer_Part_Number: CFR200J100R; Mouser Part Number: 279-CFR200J100R; Mouser Price/Stock: https://www.mouser.com/Search/Refine.aspx?Keyword=279-CFR200J100R; Arrow Part Number: CFR200J100R; Arrow Price/Stock: https://www.arrow.com/en/products/cfr200j100r/te-connectivity
R4-R6 R15 R16 R77 R78 = RES_0805
  R4: Value: 30k
R19 R20 = 306J: 3296W-1-103LF
R38 R47 R74 R76 = RES_1206
T1 = TRANSF_RF2: Value: *
T2 = TRANSF_RF1: Value: *
U19 = LT1117IST-ADJ
D35 D36 = SS14: Value: SS14
Q5 Q6 = RD100HHF1: Value: RD100HHF1

## Sheet HF_AMP_DRIVER.SchDoc: HF RF AMP DRIVER
size A4; DocumentNumber: 17; Revision: 2.0; SheetNumber: 17; SheetTotal: 18
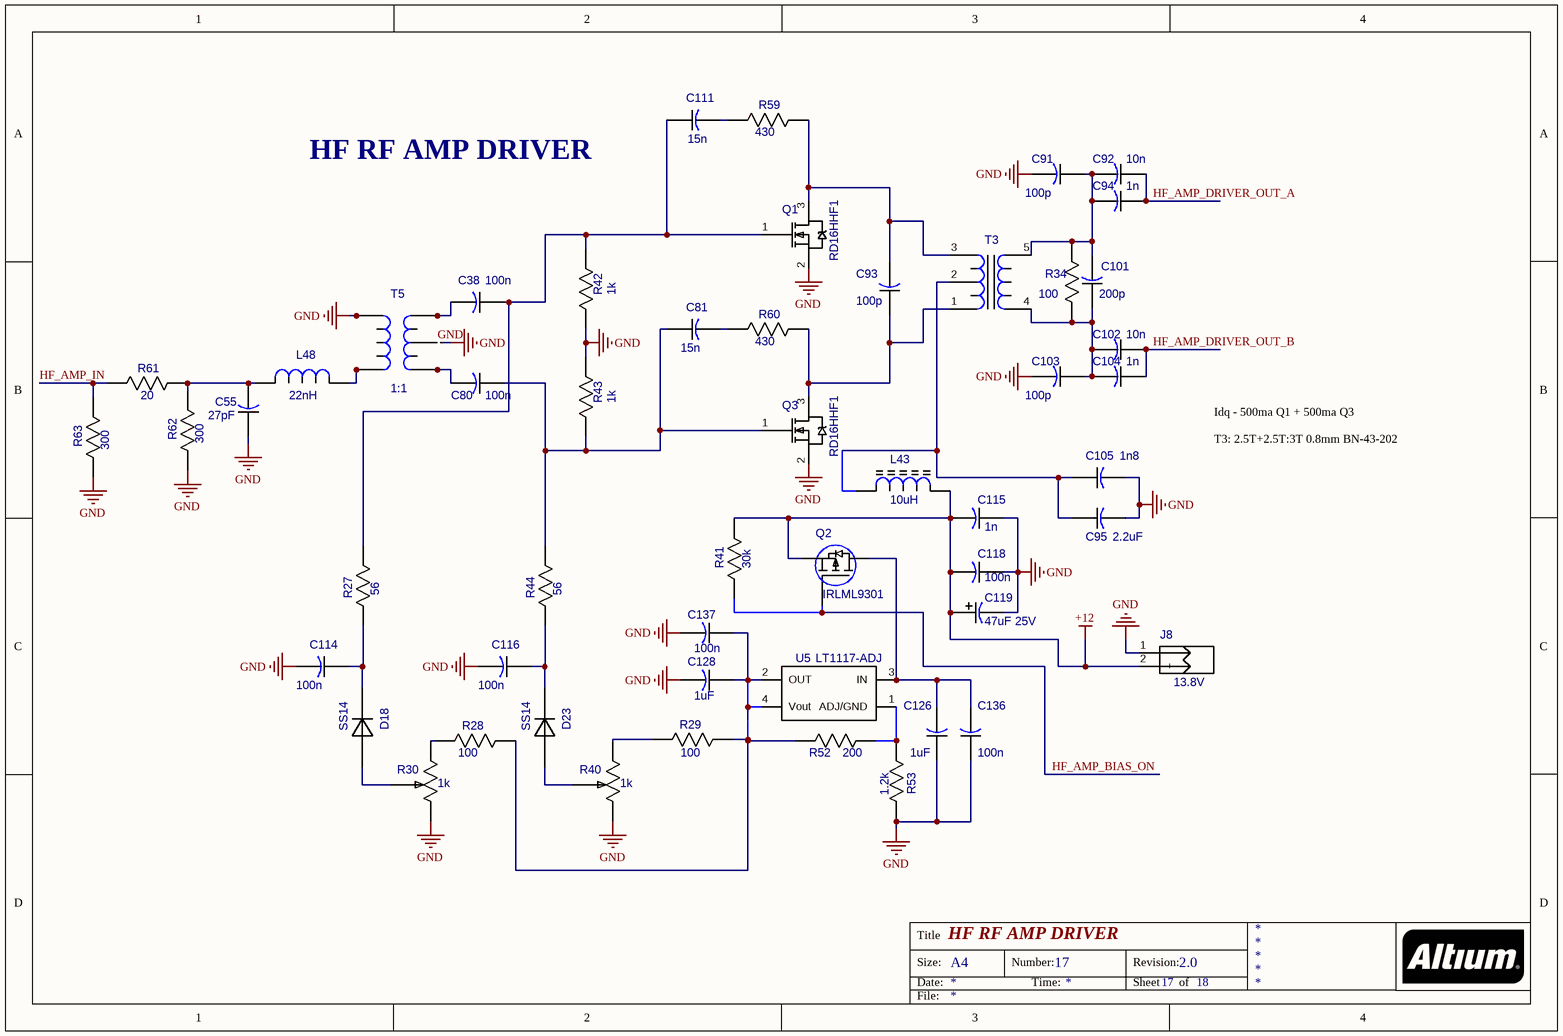
[diagram p5: HF_AMP_DRIVER.SchDoc]

### Parts
C38  100n  [CAP_0805]
C55  27pF  [CAP_0805]
C80  100n  [CAP_0805]
C81  15n  [CAP_1206]
C91  100p  [CAP_1206]
C92  10n  [CAP_1206]
C93  100p  [CAP_1206]
C94  1n  [CAP_1206]
C95  2.2uF  [CAP_1206]
C101  200p  [CAP_1206]
C102  10n  [CAP_1206]
C103  100p  [CAP_1206]
C104  1n  [CAP_1206]
C105  1n8  [CAP_1206]
C111  15n  [CAP_1206]
C114  100n  [CAP_0805]
C115  1n  [CAP_0805]
C116  100n  [CAP_0805]
C118  100n  [CAP_0805]
C119  47uF 25V  [CAPAE_6.6x6.6h5.4]
C126  1uF  [CAP_0805]
C128  1uF  [CAP_0805]
C136  100n  [CAP_0805]
C137  100n  [CAP_0805]
D18  SS14  [SS14]
D23  SS14  [SS14]
J8  13.8V  [1986717-2]
L43  10uH  [IND_FERRITE_CORE]
L48  22nH  [IND_0805]
Q1  RD16HHF1  [RD16_V2]
Q2  IRLML9301  [SOT23]
Q3  RD16HHF1  [RD16_V2]
R27  56  [RES_0805]
R28  100  [RES_0805]
R29  100  [RES_0805]
R30  value 1k  [306J]  (hidden comment: ADJ-1k)
R34  100  [RES_1206]
R40  value 1k  [306J]  (hidden comment: ADJ-1k)
R41  30k  [RES_0805]
R42  1k  [RES_0805]
R43  1k  [RES_0805]
R44  56  [RES_0805]
R52  200  [RES_0805]
R53  1.2k  [RES_0805]
R59  430  [RES_1206]
R60  430  [RES_1206]
R61  20  [RES_1206]
R62  300  [RES_1206]
R63  300  [RES_1206]
T3  TRANSF_HF3  [TRANSF_HF3]  (value not drawn)
T5  1:1  [TRANSF_ACORE2]
U5  value LT1117-ADJ  [LT1117IST-ADJ]  (hidden comment: LT1117IST-ADJ)

### Nets
+12: C115.2 C118.2 C119.1(PLUS) J8.2(+) L43.2(B) Q2.2(S) R41.2
GND: C55.1 C91.2 C95.2 C103.2 C105.2 C114.2 C115.1 C116.2 C118.1 C119.2(MINUS) C126.1 C128.2 C136.1 C137.2 J8.1(-) Q1.2(S) Q3.2(S) R30.1(CCW) R40.1(CCW) R42.1 R43.2 R53.2 R62.1 R63.1 T5.2(S2) T5.4(P2) T5.8(S2) T5.11
HF_AMP_BIAS_ON: Q2.1(G) R41.1
HF_AMP_DRIVER_OUT_A: C92.1 C94.1
HF_AMP_DRIVER_OUT_B: C102.1 C104.1
HF_AMP_IN: R61.1 R63.2
NetC38_1: C38.1 C111.1 Q1.1(G) R27.2 R42.2
NetC38_2: C38.2 T5.3(S3) T5.9
NetC55_2: C55.2 L48.1 R61.2 R62.2
NetC80_1: C80.1 C81.1 Q3.1(G) R43.1 R44.2
NetC80_2: C80.2 T5.1(S1) T5.7
NetC81_2: C81.2 R60.1
NetC91_1: C91.1 C92.2 C94.2 C101.2 R34.2 T3.5(P1)
NetC93_1: C93.1 Q3.3(D) R60.2 T3.1(S2)
NetC93_2: C93.2 Q1.3(D) R59.2 T3.3(S1)
NetC95_1: C95.1 C105.1 L43.1(A) T3.2(S3)
NetC101_1: C101.1 C102.2 C103.1 C104.2 R34.1 T3.4(P2)
NetC111_2: C111.2 R59.1
NetC114_1: C114.1 D18.1(K) R27.1
NetC116_1: C116.1 D23.1(K) R44.1
NetC126_2: C126.2 C136.2 Q2.3(D) U5.3(IN)
NetC128_1: C128.1 C137.1 R28.2 R29.2 R52.1 U5.2(OUT) U5.4(Vout)
NetD18_2: D18.2(A) R30.2(W)
NetD23_2: D23.2(A) R40.2(W)
NetL48_2: L48.2 T5.6(P1) T5.10
NetR28_1: R28.1 R30.3(CW)
NetR29_1: R29.1 R40.3(CW)
NetR52_2: R52.2 R53.1 U5.1(ADJ/GND)

### Notes on the sheet
- HF RF AMP DRIVER
- Idq - 500ma Q1 + 500ma Q3
  T3: 2.5T+2.5T:3T 0.8mm BN-43-202
- Title
- Size:
- Date:
- A4
- Number:
- Time:
- Revision:
- Sheet
- of
- File:

### Library data of the parts
C38 C55 C80 C114-C116 C118 C126 C128 C136 C137 = CAP_0805
  C114 C116 C118 C136 C137: Value: 100n
  C115: Value: 1n
  C126 C128: Value: 1uF
C81 C91-C95 C101-C105 C111 = CAP_1206
C119 = CAPAE_6.6x6.6h5.4: Value: 47uF 25V
J8 = 1986717-2: JX2; Value: 13.8V
L43 = IND_FERRITE_CORE: Inductor; Value: 10uH
L48 = IND_0805
Q2 = MOSFET_ENH_PD: MOSFET; Value: IRLML9301
R27-R29 R41-R44 R52 R53 = RES_0805
  R27 R44: Value: 56
  R41: Value: 30k
  R42 R43: Value: 1k
  R52: Value: 200
  R53: Value: 1.2k
R30 R40 = 306J
R34 R59-R63 = RES_1206
T3 = TRANSF_RF3: Value: *
T5 = TRANSF_ACORE2: Value: 1:1
D18 D23 = SS14: Value: SS14
Q1 Q3 = RD16HHF1: Value: RD16HHF1

## Sheet SWR_HF.SchDoc: HF SWR Meter
size A4; DocumentNumber: 18; Revision: 2.0; SheetNumber: 18; SheetTotal: 18
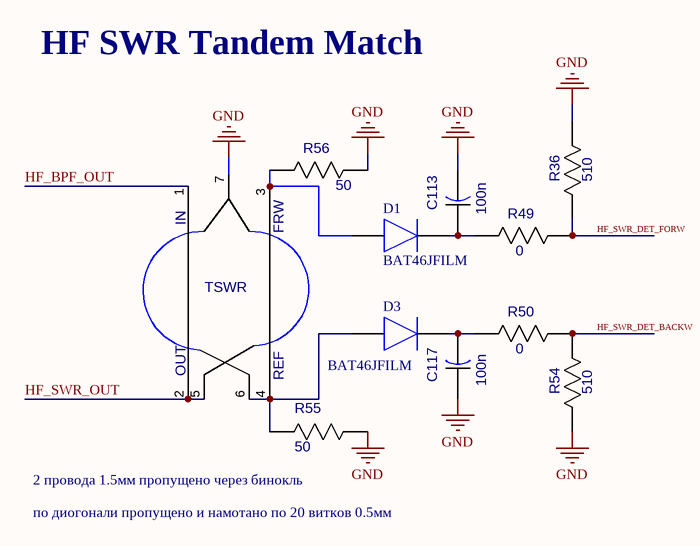
[diagram p6: SWR_HF.SchDoc]

### Parts
C113  100n  [CAP_0805]
C117  100n  [CAP_0805]
D1  BAT46JFILM  [SOD2513X117N]
D3  BAT46JFILM  [SOD2513X117N]
R36  510  [RES_0805]
R49  0  [RES_0805]
R50  0  [RES_0805]
R54  510  [RES_0805]
R55  50  [RES_1206]
R56  50  [RES_1206]
TSWR  SWR_TANDEM_MATCH  [SWR_TANDEM_MATCH]  (value not drawn)

### Nets
GND: C113.2 C117.1 R36.2 R54.1 R55.2 R56.2 TSWR.7
HF_BPF_OUT: TSWR.1
HF_SWR_DET_BACKW: R50.2 R54.2
HF_SWR_DET_FORW: R36.1 R49.2
HF_SWR_OUT: TSWR.2 TSWR.5
NetC113_1: C113.1 D1.1(K) R49.1
NetC117_2: C117.2 D3.1(K) R50.1
NetD1_2: D1.2(A) R56.1 TSWR.3
NetD3_2: D3.2(A) R55.1 TSWR.4 TSWR.6

### Notes on the sheet
- HF SWR Tandem Match
- (near R55) 2 провода 1.5мм пропущено через бинокль
- по диогонали пропущено и намотано по 20 витков 0.5мм
- Title
- Size:
- Date:
- A4
- Number:
- Time:
- Revision:
- Sheet
- of
- File:
- (in symbol SWR_TANDEM_MATCH) IN; FRW; OUT; REF

### Library data of the parts
C113 C117 = CAP_0805: Value: 100n
D1 D3 = BAT46JFILM: Diode; Manufacturer_Name: STMicroelectronics; Allied_Number: 70389791; Datasheet Link: http://www.st.com/web/en/resource/technical/document/datasheet/CD00004930.pdf; Height: 1.17mm; Manufacturer_Part_Number: BAT46JFILM; Mouser Part Number: 511-BAT46JFILM; Mouser Price/Stock: https://www.mouser.co.uk/ProductDetail/STMicroelectronics/BAT46JFILM?qs=69%252BgXnvv5lrVjJqgcSQKbQ%3D%3D; RS Part Number: 7146847P; RS Price/Stock: http://uk.rs-online.com/web/p/products/7146847P; Allied Price/Stock: http://www.alliedelec.com/stmicroelectronics-bat46jfilm/70389791/
R36 R49 R50 R54 = RES_0805
  R36 R54: Value: 510
R55 R56 = RES_1206

## Sheet VHF_AMP.SchDoc: VHF RF AMP
size A4; DocumentNumber: 17; Revision: 2.0; SheetNumber: 17; SheetTotal: 18
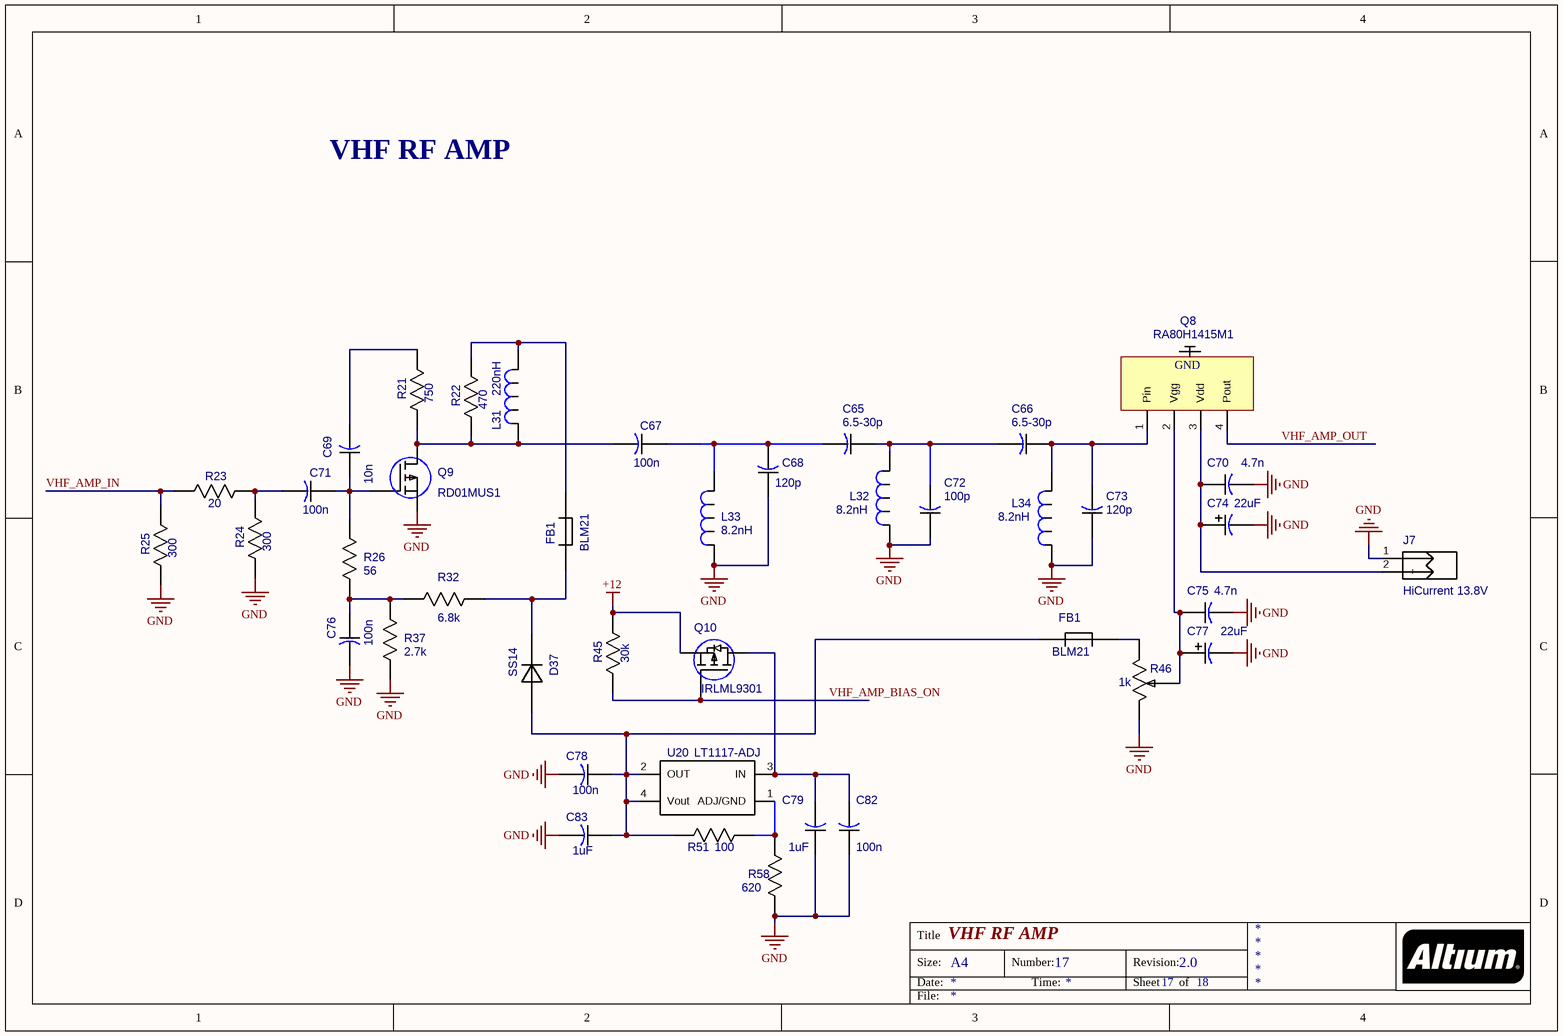
[diagram p7: VHF_AMP.SchDoc]

### Parts
(Parts that share a designator on the sheet are numbered #1, #2 ... from top to bottom, then left to right.)
C65  6.5-30p  [5025[2010]]
C66  6.5-30p  [5025[2010]]
C67  100n  [CAP_0805]
C68  120p  [CAP_0805]
C69  10n  [CAP_1206]
C70  4.7n  [CAP_0805]
C71  100n  [CAP_0805]
C72  100p  [CAP_0805]
C73  120p  [CAP_0805]
C74  22uF  [CAPAE_6.6x6.6h5.4]
C75  4.7n  [CAP_0805]
C76  100n  [CAP_0805]
C77  22uF  [CAPAE_6.6x6.6h5.4]
C78  100n  [CAP_0805]
C79  1uF  [CAP_0805]
C82  100n  [CAP_0805]
C83  1uF  [CAP_0805]
D37  SS14  [SS14]
FB1#1  BLM21  [IND_0805]
FB1#2  BLM21  [IND_0805]
J7  HiCurrent 13.8V  [1986717-2]
L31  220nH  [IND_1206]
L32  8.2nH  [IND_0805]
L33  8.2nH  [IND_0805]
L34  8.2nH  [IND_0805]
Q8  RA80H1415M1  [RA80H1415M1]
Q9  RD01MUS1  [SOT89]
Q10  IRLML9301  [SOT23]
R21  750  [RES_1206]
R22  470  [RES_1206]
R23  20  [RES_1206]
R24  300  [RES_1206]
R25  300  [RES_1206]
R26  56  [RES_0805]
R32  6.8k  [RES_0805]
R37  2.7k  [RES_0805]
R45  30k  [RES_0805]
R46  value 1k  [306J]  (hidden comment: ADJ-1k)
R51  100  [RES_0805]
R58  620  [RES_0805]
U20  value LT1117-ADJ  [LT1117IST-ADJ]  (hidden comment: LT1117IST-ADJ)

### Nets
+12: Q10.2(S) R45.2
GND: C68.1 C70.2 C72.1 C73.1 C74.2(MINUS) C75.2 C76.2 C77.2(MINUS) C78.2 C79.1 C82.1 C83.2 J7.1(-) L32.1 L33.1 L34.1 Q9.2(S) R24.1 R25.1 R37.1 R46.1(CCW) R58.2
VHF_AMP_BIAS_ON: Q10.1(G) R45.1
VHF_AMP_IN: R23.1 R25.2
VHF_AMP_OUT: Q8.4(Pout)
NetC65_1: C65.1 C66.2 C72.2 L32.2
NetC65_2: C65.2 C67.1 C68.2 L33.2
NetC66_1: C66.1 C73.2 L34.2 Q8.1(Pin)
NetC67_2: C67.2 L31.2 Q9.3(D) R21.1 R22.1
NetC69_1: C69.1 C71.1 Q9.1(G) R26.2
NetC69_2: C69.2 R21.2
NetC70_1: C70.1 C74.1(PLUS) J7.2(+) Q8.3(Vdd)
NetC71_2: C71.2 R23.2 R24.2
NetC75_1: C75.1 C77.1(PLUS) Q8.2(Vgg) R46.2(W)
NetC76_1: C76.1 R26.1 R32.2 R37.2
NetC78_1: C78.1 C83.1 D37.2(A) FB1#2.1 R51.1 U20.2(OUT) U20.4(Vout)
NetC79_2: C79.2 C82.2 Q10.3(D) U20.3(IN)
NetD37_1: D37.1(K) FB1#1.2 R32.1
NetFB1#1_1: FB1#1.1 L31.1 R22.2
NetFB1#2_2: FB1#2.2 R46.3(CW)
NetR51_2: R51.2 R58.1 U20.1(ADJ/GND)

### Notes on the sheet
- VHF RF AMP
- Title
- Size:
- Date:
- A4
- Number:
- Time:
- Revision:
- Sheet
- of
- File:
- (in symbol RA80H1415M1) GND

### Library data of the parts
C65 C66 = CAP_0805: TZC3P300A110; Value: 6.5-30p
C67 C68 C70-C73 C75 C76 C78 C79 C82 C83 = CAP_0805
  C67 C71 C76 C78 C82: Value: 100n
  C68 C73: Value: 120p
  C72: Value: 100p
  C79 C83: Value: 1uF
C69 = CAP_1206
C74 C77 = CAPAE_6.6x6.6h5.4
FB1#1 FB1#2 = IND_FERRITE_BEAD: Value: *
J7 = 1986717-2: JX2
L31 = IND_1206
L32-L34 = IND_0805: Value: 8.2nH
Q10 = MOSFET_ENH_PD: MOSFET; Value: IRLML9301
R21-R25 = RES_1206
R26 R32 R37 R45 R51 R58 = RES_0805
  R45: Value: 30k
R46 = 306J
D37 = SS14: Value: SS14
Q8 = RA80H1415M1: Value: *
Q9 = RD01MUS1: Value: *

## Sheet SWR_VHF.SchDoc: VHF SWR Meter
size A4; DocumentNumber: 18; Revision: 2.0; SheetNumber: 18; SheetTotal: 18
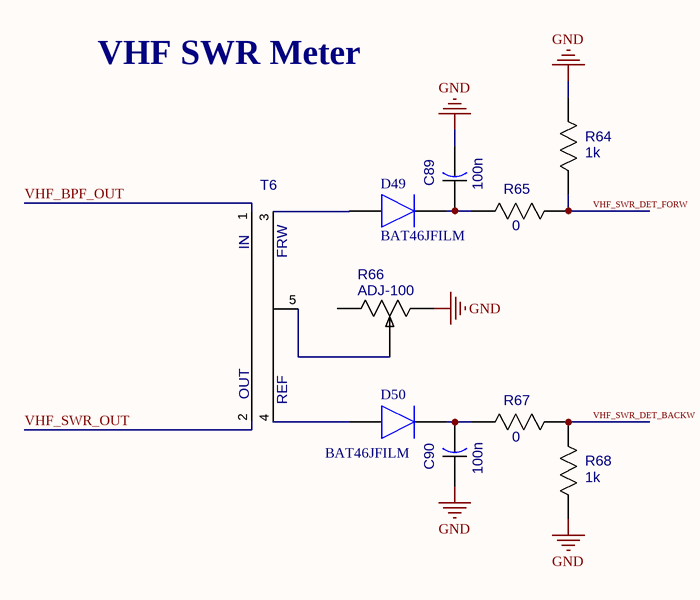
[diagram p8: SWR_VHF.SchDoc]

### Parts
C89  100n  [CAP_0805]
C90  100n  [CAP_0805]
D49  BAT46JFILM  [SOD2513X117N]
D50  BAT46JFILM  [SOD2513X117N]
R64  1k  [RES_0805]
R65  0  [RES_0805]
R66  ADJ-100  [306J]
R67  0  [RES_0805]
R68  1k  [RES_0805]
T6  SWR_VHF  [SWR_VHF]  (value not drawn)

### Nets
GND: C89.2 C90.1 R64.2 R66.1(CCW) R68.1
VHF_BPF_OUT: T6.1
VHF_SWR_DET_BACKW: R67.2 R68.2
VHF_SWR_DET_FORW: R64.1 R65.2
VHF_SWR_OUT: T6.2
NetC89_1: C89.1 D49.1(K) R65.1
NetC90_2: C90.2 D50.1(K) R67.1
NetD49_2: D49.2(A) T6.3
NetD50_2: D50.2(A) T6.4
NetR66_2: R66.2(W) T6.5

Not connected (* = marked no-connect by the designer): R66 3(CW)

### Notes on the sheet
- VHF SWR Meter
- Title
- Size:
- Date:
- A4
- Number:
- Time:
- Revision:
- Sheet
- of
- File:
- (in symbol SWR_VHF) IN; FRW; OUT; REF

### Library data of the parts
C89 C90 = CAP_0805: Value: 100n
D49 D50 = BAT46JFILM: as D1 on sheet SWR_HF; Datasheet Link: http://www.st.com/web/en/resource/technical/document/datasheet/CD00004930.pdf; Height: 1.17mm; Manufacturer_Part_Number: BAT46JFILM; Mouser Part Number: 511-BAT46JFILM; Mouser Price/Stock: https://www.mouser.co.uk/ProductDetail/STMicroelectronics/BAT46JFILM?qs=69%252BgXnvv5lrVjJqgcSQKbQ%3D%3D; RS Part Number: 7146847P; RS Price/Stock: http://uk.rs-online.com/web/p/products/7146847P; Allied Price/Stock: http://www.alliedelec.com/stmicroelectronics-bat46jfilm/70389791/
R64 R65 R67 R68 = RES_0805
R66 = 306J
T6 = SWR_VHF: Value: *

## Nets that join several sheets
+3V3: CONN (J4.1), LNA (9 pins)
+12: CONN (11 pins), LNA (13 pins), BPF (61 pins), HF_AMP (Q7.2 R4.2), HF_AMP_DRIVER (7 pins), VHF_AMP (Q10.2 R45.2)
GND: CONN (21 pins), LNA (37 pins), BPF (41 pins), HF_AMP (18 pins), HF_AMP_DRIVER (28 pins), SWR_HF (7 pins), VHF_AMP (22 pins), SWR_VHF (5 pins)
ADC: CONN (J2.5), BPF (K2.3 K2.10 K5.3 K5.10)
ANT_OUT: CONN (K1.4 K1.9), LNA (K3.4 K3.9)
HF-VHF-SELECT: CONN (6 pins), LNA (C124.1 D32.2 K24.12)
HF_AMP_BIAS_ON: HF_AMP (Q7.1 R4.1), HF_AMP_DRIVER (Q2.1 R41.1)
HF_AMP_DRIVER_OUT_A: HF_AMP (R38.1 R74.1), HF_AMP_DRIVER (C92.1 C94.1)
HF_AMP_DRIVER_OUT_B: HF_AMP (R47.1 R76.1), HF_AMP_DRIVER (C102.1 C104.1)
HF_AMP_IN: CONN (U4.2 U4.7), HF_AMP_DRIVER (R61.1 R63.2)
HF_AMP_OUT: BPF (K5.5 K5.8), HF_AMP (T1.5)
HF_BPF_OUT: BPF (18 pins), SWR_HF (TSWR.1)
HF_SWR_DET_BACKW: CONN (U12.2), SWR_HF (R50.2 R54.2)
HF_SWR_DET_FORW: CONN (U12.7), SWR_HF (R36.1 R49.2)
TX_PTT_OUT: CONN (R10.2), LNA (6 pins), BPF (6 pins)
VHF_AMP_IN: CONN (U4.4 U4.5), VHF_AMP (R23.1 R25.2)
VHF_AMP_OUT: BPF (K2.5 K2.8), VHF_AMP (Q8.4)
VHF_BPF_OUT: BPF (L2.2), SWR_VHF (T6.1)
VHF_SWR_DET_BACKW: CONN (U12.4), SWR_VHF (R67.2 R68.2)
VHF_SWR_DET_FORW: CONN (U12.5), SWR_VHF (R64.1 R65.2)
VHF_SWR_OUT: LNA (K24.5 K24.8), SWR_VHF (T6.2)